# Altium schematic sheet 01_MAIN.SchDoc: =GlobalProjectName
size 594 x 420 mm; CheckedBy: A_D; Author: A_D; SheetTotal: 1; PageSetup: Record=PageOptions|CenterHorizontal=True|CenterVertical=True|PrintScale=0.70|XCorrection=1.00|YCorrection=1.00|PrintKind=2|BorderSize=5000000|LeftOffset=9000|BottomOffset=10100|Orientation=2|PaperLength=11176|PaperWidth=8636|Scale=100|PaperSource=259|PrintQuality=-3|MediaType=1|DitherType=10|PrintScaleMode=1|PaperKind=A3|PaperIndex=8
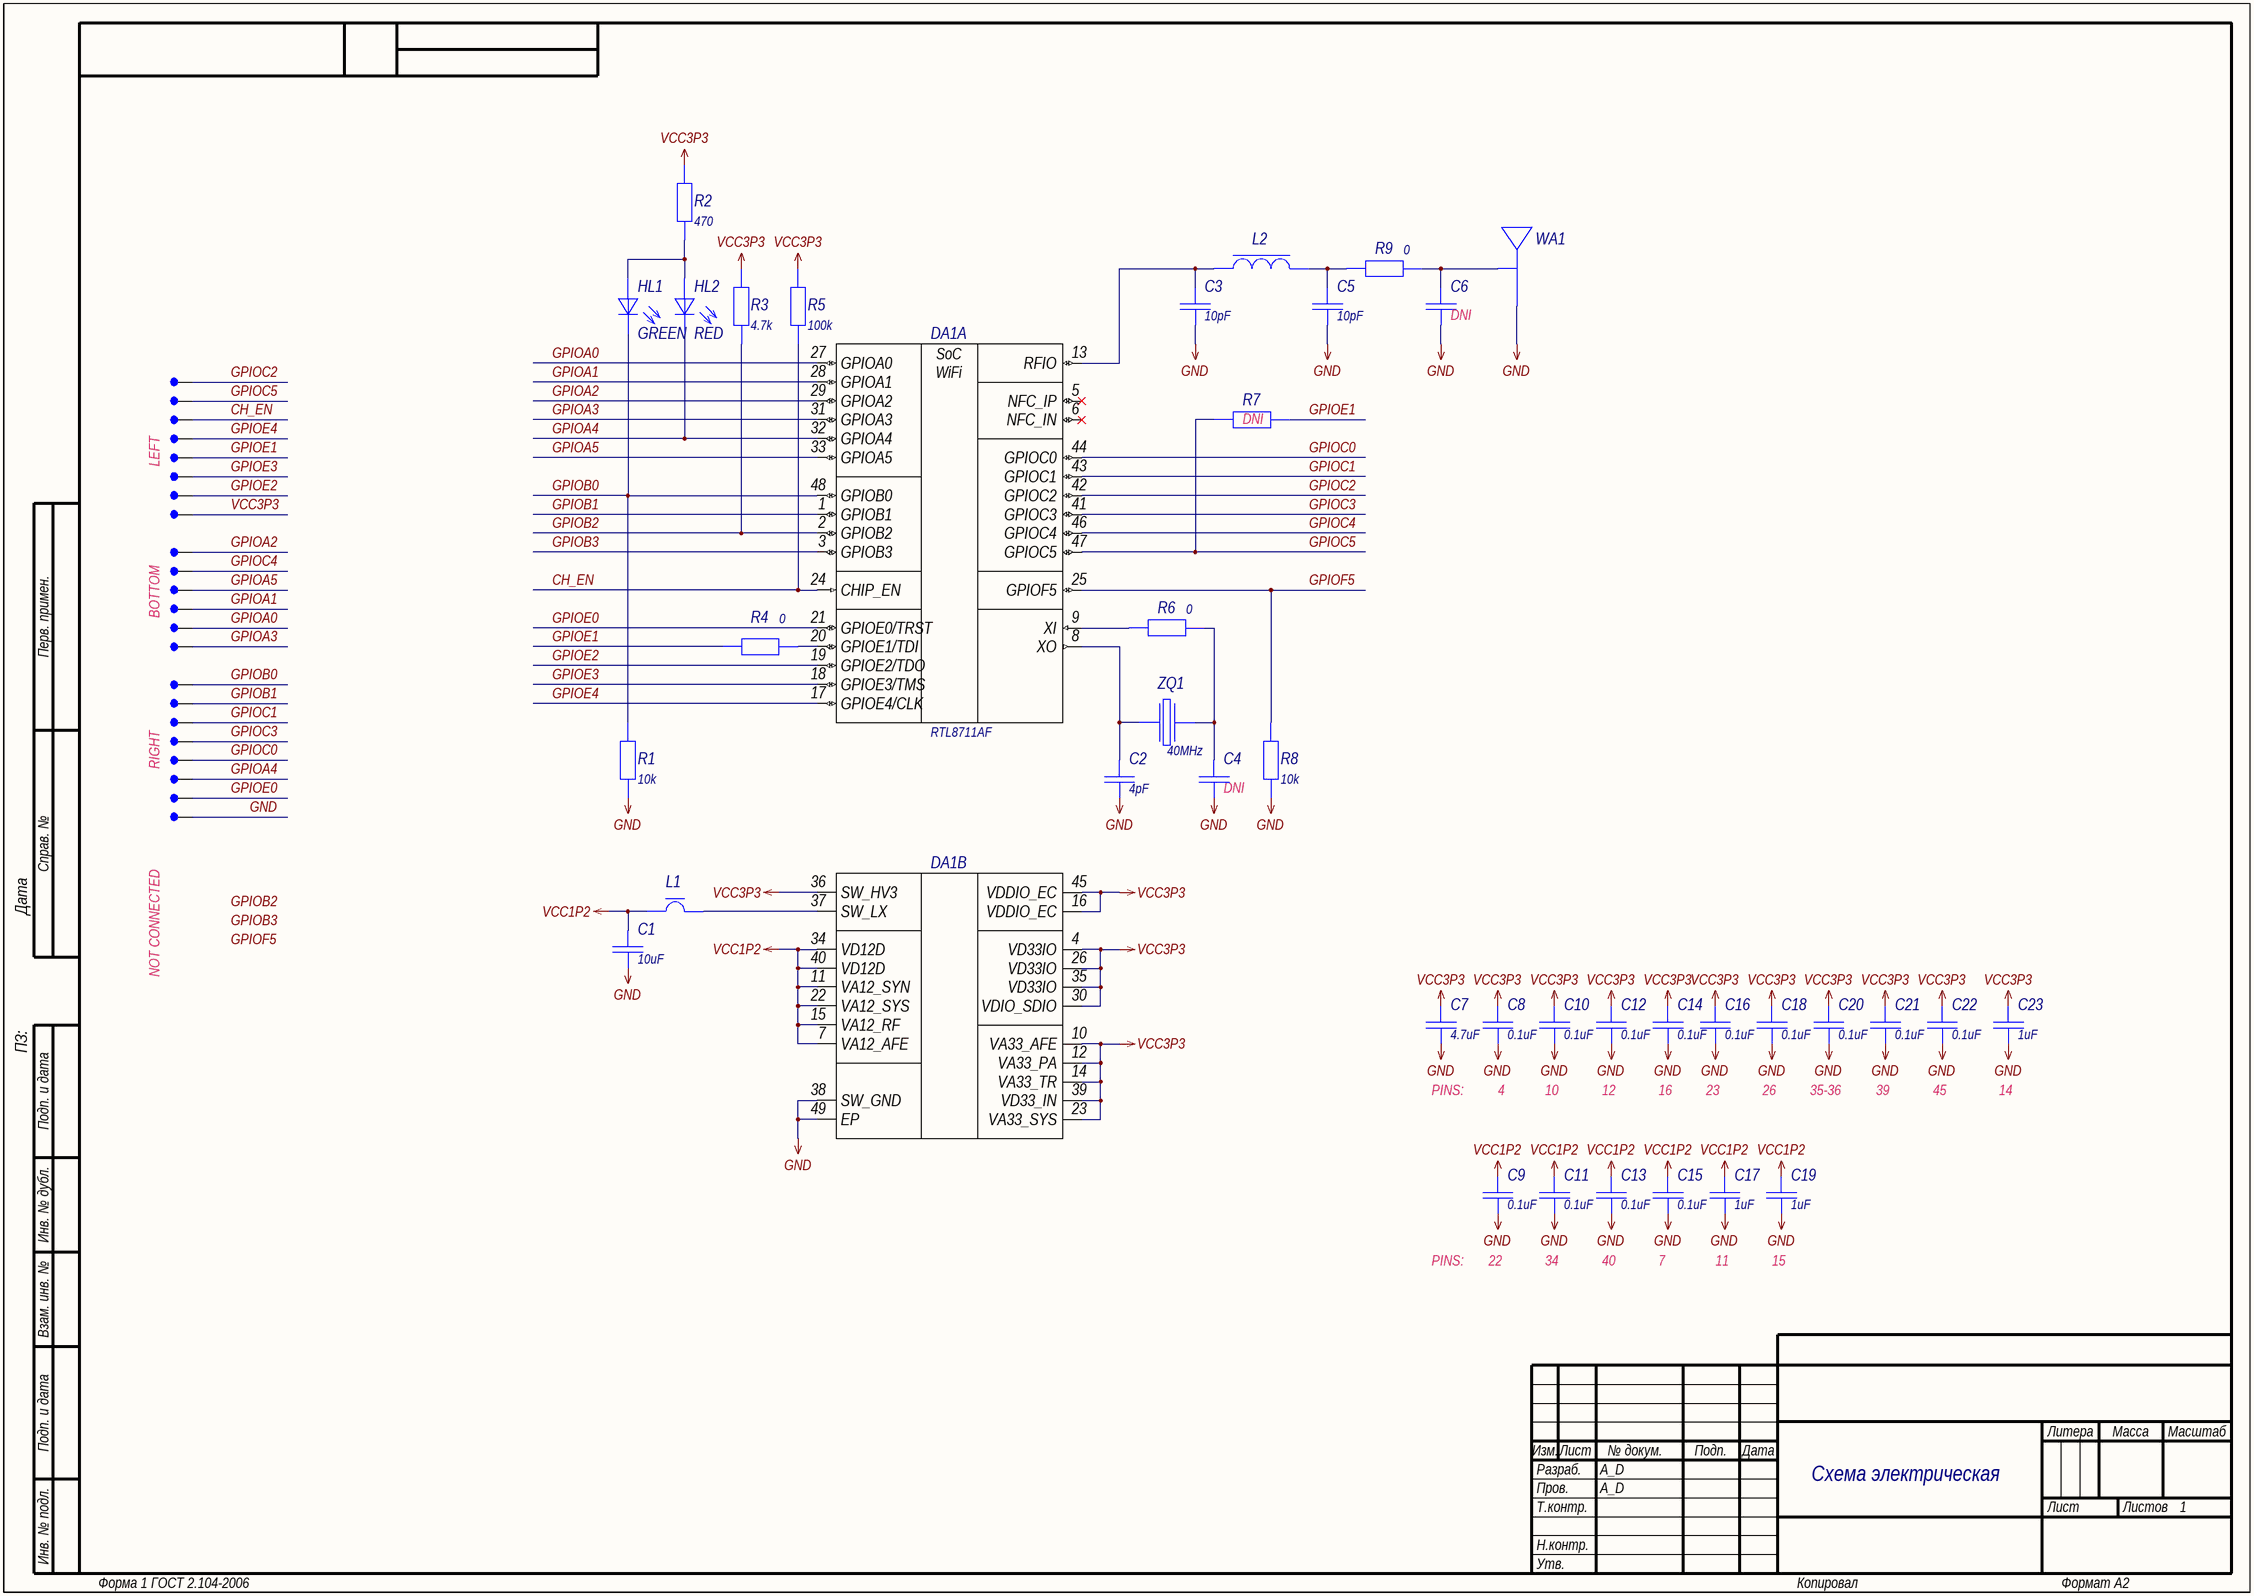
[diagram p0: 01_MAIN.SchDoc]

## Parts
C1  value 10uF  [C0603_L]  (hidden comment: Capacitor)
C2  value 4pF  [C0402_L]  (hidden comment: Capacitor)
C3  value 10pF  [C0402_L]  (hidden comment: Capacitor)
C4  Capacitor  [C0402_L]  (value not drawn)  (no BOM)
C5  value 10pF  [C0402_L]  (hidden comment: Capacitor)
C6  Capacitor  [C0402_L]  (value not drawn)  (no BOM)
C7  value 4.7uF  [C0603_L]  (hidden comment: Capacitor)
C8  value 0.1uF  [C0402_L]  (hidden comment: Capacitor)
C9  value 0.1uF  [C0402_L]  (hidden comment: Capacitor)
C10  value 0.1uF  [C0402_L]  (hidden comment: Capacitor)
C11  value 0.1uF  [C0402_L]  (hidden comment: Capacitor)
C12  value 0.1uF  [C0402_L]  (hidden comment: Capacitor)
C13  value 0.1uF  [C0402_L]  (hidden comment: Capacitor)
C14  value 0.1uF  [C0402_L]  (hidden comment: Capacitor)
C15  value 0.1uF  [C0402_L]  (hidden comment: Capacitor)
C16  value 0.1uF  [C0402_L]  (hidden comment: Capacitor)
C17  value 1uF  [C0402_L]  (hidden comment: Capacitor)
C18  value 0.1uF  [C0402_L]  (hidden comment: Capacitor)
C19  value 1uF  [C0402_L]  (hidden comment: Capacitor)
C20  value 0.1uF  [C0402_L]  (hidden comment: Capacitor)
C21  value 0.1uF  [C0402_L]  (hidden comment: Capacitor)
C22  value 0.1uF  [C0402_L]  (hidden comment: Capacitor)
C23  value 1uF  [C0402_L]  (hidden comment: Capacitor)
DA1  value RTL8711AF  [QFN-48-6x6]  (hidden comment: RTL871xAF)  (parts A,B of 2)
HL1  GREEN  [LD0402_L]
HL2  RED  [LD0402_L]
L1  FerriteBead  [L0805_L]  (value not drawn)
L2  Coil  [L0402_L]  (value not drawn)
R1  value 10k  [R0402_L]  (hidden comment: Resistor)
R2  value 470  [R0402_L]  (hidden comment: Resistor)
R3  value 4.7k  [R0402_L]  (hidden comment: Resistor)
R4  value 0  [R0402_L]  (hidden comment: Resistor)
R5  value 100k  [R0402_L]  (hidden comment: Resistor)
R6  value 0  [R0402_L]  (hidden comment: Resistor)
R7  Resistor  [R0402_L]  (value not drawn)  (no BOM)
R8  value 10k  [R0402_L]  (hidden comment: Resistor)
R9  value 0  [R0402_L]  (hidden comment: Resistor)
WA1  Antenna_PCB_2p  [PCB-AN043]  (value not drawn)  (net tie, no BOM)
XS1  PCB-SPIN  [PCB-SPIN]  (value not drawn)  (no BOM)
XS2  PCB-SPIN  [PCB-SPIN]  (value not drawn)  (no BOM)
XS3  PCB-SPIN  [PCB-SPIN]  (value not drawn)  (no BOM)
XS4  PCB-SPIN  [PCB-SPIN]  (value not drawn)  (no BOM)
XS5  PCB-SPIN  [PCB-SPIN]  (value not drawn)  (no BOM)
XS6  PCB-SPIN  [PCB-SPIN]  (value not drawn)  (no BOM)
XS7  PCB-SPIN  [PCB-SPIN]  (value not drawn)  (no BOM)
XS8  PCB-SPIN  [PCB-SPIN]  (value not drawn)  (no BOM)
XS9  PCB-SPIN  [PCB-SPIN]  (value not drawn)  (no BOM)
XS10  PCB-SPIN  [PCB-SPIN]  (value not drawn)  (no BOM)
XS11  PCB-SPIN  [PCB-SPIN]  (value not drawn)  (no BOM)
XS12  PCB-SPIN  [PCB-SPIN]  (value not drawn)  (no BOM)
XS13  PCB-SPIN  [PCB-SPIN]  (value not drawn)  (no BOM)
XS14  PCB-SPIN  [PCB-SPIN]  (value not drawn)  (no BOM)
XS15  PCB-SPIN  [PCB-SPIN]  (value not drawn)  (no BOM)
XS16  PCB-SPIN  [PCB-SPIN]  (value not drawn)  (no BOM)
XS17  PCB-SPIN  [PCB-SPIN]  (value not drawn)  (no BOM)
XS18  PCB-SPIN  [PCB-SPIN]  (value not drawn)  (no BOM)
XS19  PCB-SPIN  [PCB-SPIN]  (value not drawn)  (no BOM)
XS20  PCB-SPIN  [PCB-SPIN]  (value not drawn)  (no BOM)
XS21  PCB-SPIN  [PCB-SPIN]  (value not drawn)  (no BOM)
XS22  PCB-SPIN  [PCB-SPIN]  (value not drawn)  (no BOM)
ZQ1  Output Frequency: 40MHz  [SX-2520]  (hidden comment: Crystal)

## Nets
GND: C1.1 C2.1 C3.1 C4.1 C5.1 C6.1 C7.1 C8.1 C9.1 C10.1 C11.1 C12.1 C13.1 C14.1 C15.1 C16.1 C17.1 C18.1 C19.1 C20.1 C21.1 C22.1 C23.1 DA1.38(SW_GND) DA1.49(EP) R1.1 R8.1 WA1.2 XS22.1
VCC1P2: C1.2 C9.2 C11.2 C13.2 C15.2 C17.2 C19.2 DA1.7(VA12_AFE) DA1.11(VA12_SYN) DA1.15(VA12_RF) DA1.22(VA12_SYS) DA1.34(VD12D) DA1.40(VD12D) L1.1
VCC3P3: C7.2 C8.2 C10.2 C12.2 C14.2 C16.2 C18.2 C20.2 C21.2 C22.2 C23.2 DA1.4(VD33IO) DA1.10(VA33_AFE) DA1.12(VA33_PA) DA1.14(VA33_TR) DA1.16(VDDIO_EC) DA1.23(VA33_SYS) DA1.26(VD33IO) DA1.30(VDIO_SDIO) DA1.35(VD33IO) DA1.36(SW_HV3) DA1.39(VD33_IN) DA1.45(VDDIO_EC) R2.2 R3.2 R5.2 XS8.1
CH_EN: DA1.24(CHIP_EN) R5.1 XS3.1
GPIOA0: DA1.27(GPIOA0) XS13.1
GPIOA1: DA1.28(GPIOA1) XS12.1
GPIOA2: DA1.29(GPIOA2) XS9.1
GPIOA3: DA1.31(GPIOA3) XS14.1
GPIOA4: DA1.32(GPIOA4) HL2.2(К) XS20.1
GPIOA5: DA1.33(GPIOA5) XS11.1
GPIOB0: DA1.48(GPIOB0) HL1.2(К) R1.2 XS15.1
GPIOB1: DA1.1(GPIOB1) XS16.1
GPIOB2: DA1.2(GPIOB2) R3.1
GPIOB3: DA1.3(GPIOB3)
GPIOC0: DA1.44(GPIOC0) XS19.1
GPIOC1: DA1.43(GPIOC1) XS17.1
GPIOC2: DA1.42(GPIOC2) XS1.1
GPIOC3: DA1.41(GPIOC3) XS18.1
GPIOC4: DA1.46(GPIOC4) XS10.1
GPIOC5: DA1.47(GPIOC5) R7.1 XS2.1
GPIOE0: DA1.21(GPIOE0/TRST) XS21.1
GPIOE1: R4.1 R7.2 XS5.1
GPIOE2: DA1.19(GPIOE2/TDO) XS7.1
GPIOE3: DA1.18(GPIOE3/TMS) XS6.1
GPIOE4: DA1.17(GPIOE4/CLK) XS4.1
GPIOF5: DA1.25(GPIOF5) R8.2
NetC2_2: C2.2 DA1.8(XO) ZQ1.1
NetC3_2: C3.2 DA1.13(RFIO) L2.1
NetC4_2: C4.2 R6.2 ZQ1.3
NetC5_2: C5.2 L2.2 R9.1
NetC6_2: C6.2 R9.2 WA1.1
NetDA1_9: DA1.9(XI) R6.1
NetDA1_20: DA1.20(GPIOE1/TDI) R4.2
NetDA1_37: DA1.37(SW_LX) L1.2
NetHL1_1: HL1.1(А) HL2.1(А) R2.1

Not connected (* = marked no-connect by the designer): DA1 5(NFC_IP)* 6(NFC_IN)*

## Notes on the sheet
- (near C6) DNI
- (near R7) DNI
- LEFT
- BOTTOM
- RIGHT
- (near C4) DNI
- NOT CONNECTED
- PINS:
- 4
- 10
- 12
- 16
- 23
- 26
- 35-36
- 39
- 45
- 14
- 22
- 34
- 40
- 7
- 11
- 15
- Схема электрическая
  принципиальная
- Labels drawn without touching a wire or pin: GPIOB2, GPIOB3, GPIOF5
- Перв. примен.
- Справ. №
- ПЗ:                             Дата
- Подп. и дата
- Инв. № дубл.
- Взам. инв. №
- Разраб.
- Изм.
- Лист
- № докум.
- Подп.
- Дата
- Литера
- Масса
- Масштаб
- Пров.
- Т.контр.
- Листов
- Инв. № подл.
- Н.контр.
- Утв.
- Форма 1 ГОСТ 2.104-2006
- Копировал
- Формат А2
- (in symbol RTL8711AF, part A) SoC; WiFi

## Library data of the parts
C1 = GRM188R60J106ME47D: Manufacturer: Murata; Type: Конденсатор; ID: 136; Voltage: 6.3V; Tolerance: ±20%; Dielectric Type: X5R; Application Category: 1; Working Temperature Min: -55°С; Working Temperature Max: +85°С; Published: 18.05.2010; Publisher: Andrew Danich; Part Number: GRM188R60J106ME47D; Footprint: 0603
C2 = GRM1555C1H4R0CZ01D: Manufacturer: Murata; Type: Конденсатор; ID: 197; Voltage: 50V; Tolerance: ±0.25pF; Dielectric Type: NP0; Application Category: 1; Working Temperature Min: -55°С; Working Temperature Max: +125°С; Published: 18.05.2010; Publisher: Andrew Danich; Part Number: GRM1555C1H4R0CZ01D; Footprint: 0402
C3 C5 = GRM1555C1H100JA01D: Manufacturer: Murata; Type: Конденсатор; ID: 194; Voltage: 50V; Tolerance: ±5%; Dielectric Type: NP0; Application Category: 1; Working Temperature Min: -55°С; Working Temperature Max: +125°С; Published: 18.05.2010; Publisher: Andrew Danich; Part Number: GRM1555C1H100JA01D; Footprint: 0402
C4 = GRM1555C1H4R0CZ01D: Manufacturer: Murata; Type: Конденсатор; ID: 197; Value: 4pF; Voltage: 50V; Tolerance: ±0.25pF; Dielectric Type: NP0; Application Category: 1; Working Temperature Min: -55°С; Working Temperature Max: +125°С; Published: 18.05.2010; Publisher: Andrew Danich; Part Number: GRM1555C1H4R0CZ01D; Footprint: 0402
C6 = GRM1555C1H100JA01D: Manufacturer: Murata; Type: Конденсатор; ID: 194; Value: 10pF; Voltage: 50V; Tolerance: ±5%; Dielectric Type: NP0; Application Category: 1; Working Temperature Min: -55°С; Working Temperature Max: +125°С; Published: 18.05.2010; Publisher: Andrew Danich; Part Number: GRM1555C1H100JA01D; Footprint: 0402
C7 = GRM188R61A475KE15D: Manufacturer: Murata; Type: Конденсатор; ID: 175; Voltage: 10V; Tolerance: ±10%; Dielectric Type: X5R; Application Category: 1; Published: 18.05.2010; Publisher: Andrew Danich; Part Number: GRM188R61A475KE15D; Footprint: 0603
C8-C16 C18 C20-C22 = GRM155R71A104KA01D: Manufacturer: Murata; Type: Конденсатор; ID: 151; Voltage: 10V; Tolerance: ±10%; Dielectric Type: X7R; Published: 18.05.2010; Publisher: Andrew Danich; Part Number: GRM155R71A104KA01D; Footprint: 0402
C17 C19 C23 = GRM155R61A105KE15D: Manufacturer: Murata; Type: Конденсатор; ID: 179; Voltage: 10V; Tolerance: ±10%; Dielectric Type: X5R; Application Category: 1; Working Temperature Min: -55°С; Working Temperature Max: +125°С; Published: 18.05.2010; Publisher: Andrew Danich; Part Number: GRM155R61A105KE15D; Footprint: 0402
DA1 = RTL8711AF: Manufacturer: Realtek; ID: 3; Supply Operation: +3.0…3.6V; Supply Current: 150mA; Flash: Internal; Wireless Compatibility: WiFi 802.11 b/g/n, 802.11e; Supported Interfaces: SDIO, I2C, I2S, PCM, SPI, UART; I/O Lines: 21; Operation Frequency: 83\166MHz; Application Category: 1; Working Temperature Min: -20°С; Working Temperature Max: +85°С; Functional Analog: RTL8710AF; Published: 06.01.2017; Publisher: Andrew Danich; Type: Микросхема; Part Number: RTL8711AF
HL1 = KPHHS-1005MGCK: Manufacturer: Kingbright; Type: Индикатор единичный; ID: 25; Forward Voltage: 2.1V; Forward Current: 20mA; Power Dissipation: 75mW; Luminous Flux: 60; Leds: 1; Working Temperature Min: -40°С; Working Temperature Max: +85°С; Published: 03.12.2013; Publisher: Andrew Danich; Part Number: KPHHS-1005MGCK; Value: KPHHS-1005MGCK; Color: Green; Footprint: 0402; Application Category: 1
HL2 = KPHHS-1005QBC-D-V: Manufacturer: Kingbright; Type: Индикатор единичный; ID: 24; Forward Voltage: 3.3V; Forward Current: 20mA; Power Dissipation: 120mW; Luminous Flux: 60; Color: Blue; Leds: 1; Working Temperature Min: -40°С; Working Temperature Max: +85°С; Published: 03.12.2013; Publisher: Andrew Danich; Part Number: KPHHS-1005QBC-D-V; Value: KPHHS-1005QBC-D-V; Footprint: 0402; Application Category: 1
L1 = BLM21PG331SN1: Manufacturer: Murata; Type: Дроссель; ID: 2; Rated Current: 1.5A; Impedance at 100Mhz: 330ohm; DC Resistance: 0.07ohm; Inductor Type: EMIFIL; Application Category: 1; Working Temperature Min: -55°С; Working Temperature Max: +125°С; Published: 14.11.2014; Publisher: Andrew Danich; Part Number: BLM21PG331SN1; Value: BLM21PG331SN1; Footprint: 0805
L2 = LQG15HS2N2S02D: Manufacturer: Murata; Type: Дроссель; ID: 84; Rated Current: 300mA; Tolerance: ±0.3nH; Inductance: 2.2nH; Application Category: 1; Published: 20.05.2010; Publisher: Andrew Danich; Part Number: LQG15HS2N2S02D; Value: LQG15HS2N2S02D; Footprint: 0402
R1 R8 = RC0402FR-0710KL: Manufacturer: Yageo; ID: 2; Limit Voltage: 50V; Tolerance: ±1%; Temperature Coefficient: 100ppm; Total Power Dissipation: 0.1W; Series Type: Thick-Film; Application Category: 1; Working Temperature Min: -55°С; Working Temperature Max: +155°С; Published: 24.03.2010; Publisher: Andrew Danich; Type: Резистор; Part Number: RC0402FR-0710KL; Footprint: 0402
R2 = RC0402JR-07430RL: Manufacturer: Yageo; ID: 376; Limit Voltage: 50V; Tolerance: ±5%; Temperature Coefficient: 100ppm; Total Power Dissipation: 0.1W; Series Type: Thick-Film; Application Category: 1; Working Temperature Min: -55°С; Working Temperature Max: +155°С; Published: 24.03.2010; Publisher: Andrew Danich; Type: Резистор; Part Number: RC0402JR-07430RL; Footprint: 0402
R3 = RC0402JR-074K7L: Manufacturer: Yageo; ID: 4; Limit Voltage: 50V; Tolerance: ±5%; Temperature Coefficient: 100ppm; Total Power Dissipation: 0.1W; Series Type: Thick-Film; Application Category: 1; Working Temperature Min: -55°С; Working Temperature Max: +155°С; Published: 24.03.2010; Publisher: Andrew Danich; Type: Резистор; Part Number: RC0402JR-074K7L; Footprint: 0402
R4 R6 R9 = RC0402JR-070RL: Manufacturer: Yageo; ID: 362; Limit Voltage: 50V; Tolerance: ±1%; Temperature Coefficient: 100ppm; Total Power Dissipation: 0.1W; Series Type: Thick-Film; Application Category: 1; Working Temperature Min: -55°С; Working Temperature Max: +155°С; Published: 24.03.2010; Publisher: Andrew Danich; Type: Резистор; Part Number: RC0402JR-070RL; Footprint: 0402
R5 = RC0402JR-07100KL: Manufacturer: Yageo; ID: 351; Limit Voltage: 50V; Tolerance: ±5%; Temperature Coefficient: 100ppm; Total Power Dissipation: 0.1W; Series Type: Thick-Film; Application Category: 1; Working Temperature Min: -55°С; Working Temperature Max: +155°С; Published: 24.03.2010; Publisher: Andrew Danich; Type: Резистор; Part Number: RC0402JR-07100KL; Footprint: 0402
R7 = RC0402JR-070RL: Manufacturer: Yageo; ID: 362; Value: 0; Limit Voltage: 50V; Tolerance: ±1%; Temperature Coefficient: 100ppm; Total Power Dissipation: 0.1W; Series Type: Thick-Film; Application Category: 1; Working Temperature Min: -55°С; Working Temperature Max: +155°С; Published: 24.03.2010; Publisher: Andrew Danich; Type: Резистор; Part Number: RC0402JR-070RL; Footprint: 0402
WA1 = PCB-AN043: Manufacturer: Texas Instruments; ID: 2; Center Frequency: 2.45GHz; Input Impedance: 50ohm; Application Category: 1; Published: 08.01.2017; Type: Антенна; Publisher: Andrew Danich; Part Number: PCB-AN043; Value: PCB-AN043; Functional Analog: -
ZQ1 = CX2520DB40000D0FLJCC: Manufacturer: AVX / Kyocera; ID: 24; Load Capacitance: 8pF; Temperature Coefficient: ±15ppm; Application Category: 1; Working Temperature Min: -30°С; Working Temperature Max: +85°С; Drive Level: 10uW; Published: 08.03.2013; Publisher: Andrew Danich; Type: Резонатор; Part Number: CX2520DB40000D0FLJCC; Value: CX2520DB40000D0FLJCC